# Altium schematic sheet YA-S-RaspberryPi-V1.0.SchDoc: Yet Another IoT BroadRouter
size A4; Revision: 1.0; SheetNumber: 5; SheetTotal: 5
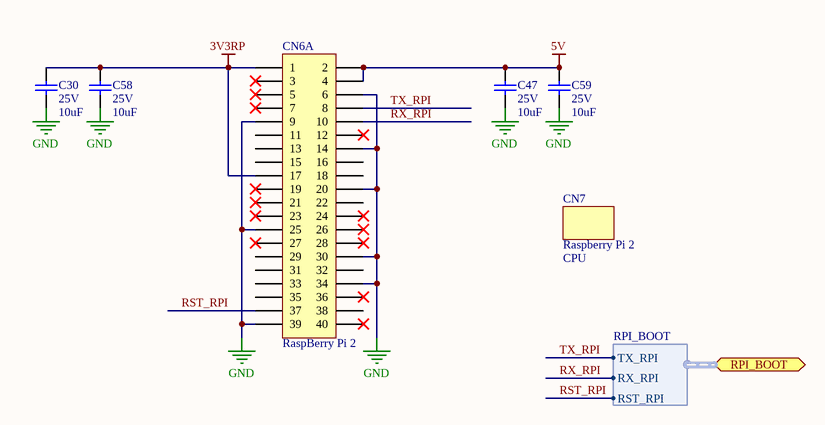
[diagram p0: YA-S-RaspberryPi-V1.0.SchDoc]

## Parts
C30  value 10uF  Tensão: 25V  [CC0805]  (hidden comment: Capacitor Cerâmico)
C47  value 10uF  Tensão: 25V  [CC0805]  (hidden comment: Capacitor Cerâmico)
C58  value 10uF  Tensão: 25V  [CC0805]  (hidden comment: Capacitor Cerâmico)
C59  value 10uF  Tensão: 25V  [CC0805]  (hidden comment: Capacitor Cerâmico)
CN6  RaspBerry Pi 2  [MOD_RASPBERRY.PI2]  (part A of 2)
CN7  Raspberry Pi 2  value CPU  [N/A]

## Ports
RPI_BOOT (harness RPI_BOOT)

## Harnesses
RPI_BOOT: TX_RPI, RX_RPI, RST_RPI

## Nets
3V3RP: C30.2 C58.2 CN6.1 CN6.17
5V: C47.2 C59.2 CN6.2 CN6.4
GND: C30.1 C47.1 C58.1 C59.1 CN6.6 CN6.9 CN6.14 CN6.20 CN6.25 CN6.30 CN6.34 CN6.39
RST_RPI: CN6.37 ; port RPI_BOOT.RST_RPI
RX_RPI: CN6.10 ; port RPI_BOOT.RX_RPI
TX_RPI: CN6.8 ; port RPI_BOOT.TX_RPI

Not connected (* = marked no-connect by the designer): CN6 3* 5* 7* 11 12* 13 15 16 18 19* 21* 22 23* 24* 26* 27* 28* 29 31 32 33 35 36* 38 40*

## Notes on the sheet
- Projeto:
- Tamanho:
- Data:
- A4
- Eng. Felipe Navarro
- Hora:
- Revisão:
- Folha
- de
- Arquivo:

## Library data of the parts
C30 C47 C58 C59 = Cap 10uF 25V 0805 X5R: Capacitor (Semiconductor SIM Model); Chinês: Local; ChinesePrice: 0,02620; Corrente: *A; Potência: *W; Obs:: X5R; Tolerância: ±10%; Supplier 1: Digi-Key; Supplier Part Number 1: 587-2985-1-ND; ComponentLink1Description: Datasheet; ComponentLink1URL: D:\Tecnoclade\Datasheet\!DataMissing.pdf
CN6 = RaspBerry Pi2: Modulo RaspBerry Pi 2; ChinesePrice: 0,00000; Chinês: ----; Corrente: *; Potência: *; Supplier 1: Digi-Key; Supplier Part Number 1: S6104-ND; Tensão: *; Value: *; Obs:: *; Tolerância: *; ComponentLink1Description: Datasheet; ComponentLink1URL: D:\Tecnoclade\Datasheet\!DataMissing.pdf
CN7 = Conector Plug: Chinês: Local; ChinesePrice: 35,00000; Corrente: *; Tensão: *; Supplier 1: Digi-Key; Supplier Part Number 1: 1690-1005-ND; Potência: *; ComponentLink1Description: Datasheet; ComponentLink1URL: D:\Tecnoclade\Datasheet\!DataMissing.pdf